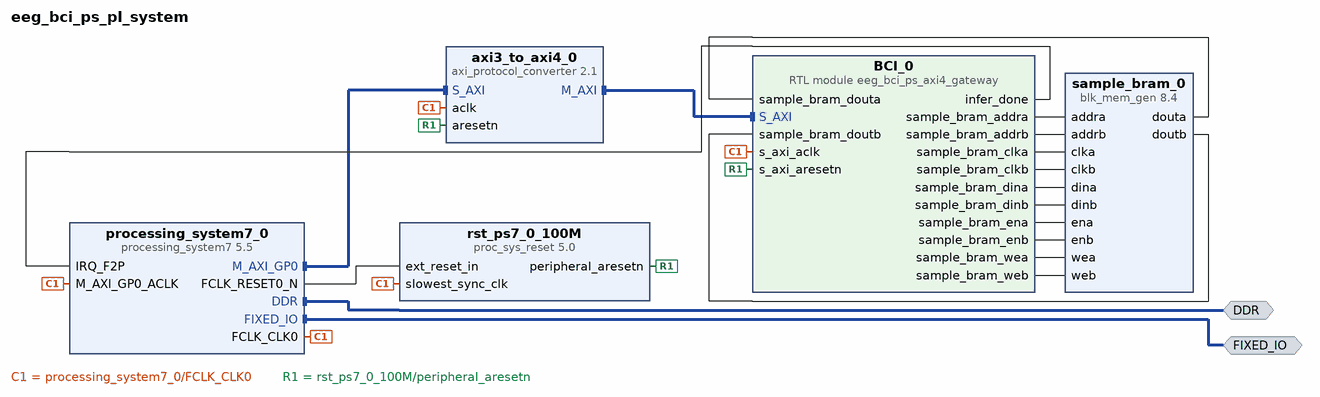
[diagram p0: block diagram of the top level]
# Vivado block design eeg_bci_ps_pl_system, xc7z020clg400-1, Vivado 2024.2
create_bd_design eeg_bci_ps_pl_system

create_bd_intf_port -mode Master -vlnv xilinx.com:interface:ddrx_rtl:1.0 DDR
create_bd_intf_port -mode Master -vlnv xilinx.com:display_processing_system7:fixedio_rtl:1.0 FIXED_IO

create_bd_cell -type ip -vlnv xilinx.com:ip:processing_system7:5.5 processing_system7_0
set_property -dict [list \
  CONFIG.PCW_ENET0_ENET0_IO {MIO 16 .. 27} \
  CONFIG.PCW_ENET0_GRP_MDIO_ENABLE 1 \
  CONFIG.PCW_ENET0_GRP_MDIO_IO {MIO 52 .. 53} \
  CONFIG.PCW_ENET0_PERIPHERAL_ENABLE 1 \
  CONFIG.PCW_FPGA0_PERIPHERAL_FREQMHZ 70 \
  CONFIG.PCW_IRQ_F2P_INTR 1 \
  CONFIG.PCW_PRESET_BANK1_VOLTAGE {LVCMOS 1.8V} \
  CONFIG.PCW_UART0_PERIPHERAL_ENABLE 1 \
  CONFIG.PCW_UART0_UART0_IO {MIO 14 .. 15} \
  CONFIG.PCW_UART_PERIPHERAL_FREQMHZ 100 \
  CONFIG.PCW_UIPARAM_DDR_PARTNO {MT41K256M16 RE-125} \
  CONFIG.PCW_USE_FABRIC_INTERRUPT 1 \
] [get_bd_cells processing_system7_0]
# 96 more settings of processing_system7_0 are not shown: defaults, MIO pin electricals, DDR timing, and values the tool derives
create_bd_cell -type module -reference eeg_bci_ps_axi4_gateway BCI_0
create_bd_cell -type ip -vlnv xilinx.com:ip:axi_protocol_converter:2.1 axi3_to_axi4_0
set_property -dict {CONFIG.MI_PROTOCOL AXI4 CONFIG.SI_PROTOCOL AXI3} [get_bd_cells axi3_to_axi4_0]
create_bd_cell -type ip -vlnv xilinx.com:ip:blk_mem_gen:8.4 sample_bram_0
set_property -dict [list \
  CONFIG.Enable_32bit_Address true \
  CONFIG.Enable_B Use_ENB_Pin \
  CONFIG.Memory_Type True_Dual_Port_RAM \
  CONFIG.Read_Width_A 32 \
  CONFIG.Read_Width_B 32 \
  CONFIG.Register_PortA_Output_of_Memory_Primitives false \
  CONFIG.Register_PortB_Output_of_Memory_Primitives false \
  CONFIG.Use_RSTA_Pin false \
  CONFIG.Use_RSTB_Pin false \
  CONFIG.Write_Width_A 32 \
  CONFIG.Write_Width_B 32 \
] [get_bd_cells sample_bram_0]
create_bd_cell -type ip -vlnv xilinx.com:ip:proc_sys_reset:5.0 rst_ps7_0_100M

# ---- connections ----

connect_bd_intf_net [get_bd_intf_pins axi3_to_axi4_0/M_AXI] [get_bd_intf_pins BCI_0/S_AXI]
connect_bd_intf_net [get_bd_intf_ports DDR] [get_bd_intf_pins processing_system7_0/DDR]
connect_bd_intf_net [get_bd_intf_ports FIXED_IO] [get_bd_intf_pins processing_system7_0/FIXED_IO]
connect_bd_intf_net [get_bd_intf_pins processing_system7_0/M_AXI_GP0] [get_bd_intf_pins axi3_to_axi4_0/S_AXI]
connect_bd_net [get_bd_pins BCI_0/infer_done] [get_bd_pins processing_system7_0/IRQ_F2P]
connect_bd_net [get_bd_pins BCI_0/sample_bram_addra] [get_bd_pins sample_bram_0/addra]
connect_bd_net [get_bd_pins BCI_0/sample_bram_addrb] [get_bd_pins sample_bram_0/addrb]
connect_bd_net [get_bd_pins BCI_0/sample_bram_clka] [get_bd_pins sample_bram_0/clka]
connect_bd_net [get_bd_pins BCI_0/sample_bram_clkb] [get_bd_pins sample_bram_0/clkb]
connect_bd_net [get_bd_pins BCI_0/sample_bram_dina] [get_bd_pins sample_bram_0/dina]
connect_bd_net [get_bd_pins BCI_0/sample_bram_dinb] [get_bd_pins sample_bram_0/dinb]
connect_bd_net [get_bd_pins BCI_0/sample_bram_ena] [get_bd_pins sample_bram_0/ena]
connect_bd_net [get_bd_pins BCI_0/sample_bram_enb] [get_bd_pins sample_bram_0/enb]
connect_bd_net [get_bd_pins BCI_0/sample_bram_wea] [get_bd_pins sample_bram_0/wea]
connect_bd_net [get_bd_pins BCI_0/sample_bram_web] [get_bd_pins sample_bram_0/web]
connect_bd_net [get_bd_pins processing_system7_0/FCLK_CLK0] \
  [get_bd_pins processing_system7_0/M_AXI_GP0_ACLK] [get_bd_pins axi3_to_axi4_0/aclk] [get_bd_pins BCI_0/s_axi_aclk] \
  [get_bd_pins rst_ps7_0_100M/slowest_sync_clk]
connect_bd_net [get_bd_pins processing_system7_0/FCLK_RESET0_N] [get_bd_pins rst_ps7_0_100M/ext_reset_in]
connect_bd_net [get_bd_pins rst_ps7_0_100M/peripheral_aresetn] [get_bd_pins axi3_to_axi4_0/aresetn] [get_bd_pins BCI_0/s_axi_aresetn]
connect_bd_net [get_bd_pins sample_bram_0/douta] [get_bd_pins BCI_0/sample_bram_douta]
connect_bd_net [get_bd_pins sample_bram_0/doutb] [get_bd_pins BCI_0/sample_bram_doutb]

# ---- address map ----
assign_bd_address -offset 0x40000000 -range 64M -target_address_space [get_bd_addr_spaces processing_system7_0/Data] [get_bd_addr_segs BCI_0/S_AXI/reg0]

validate_bd_design
save_bd_design
